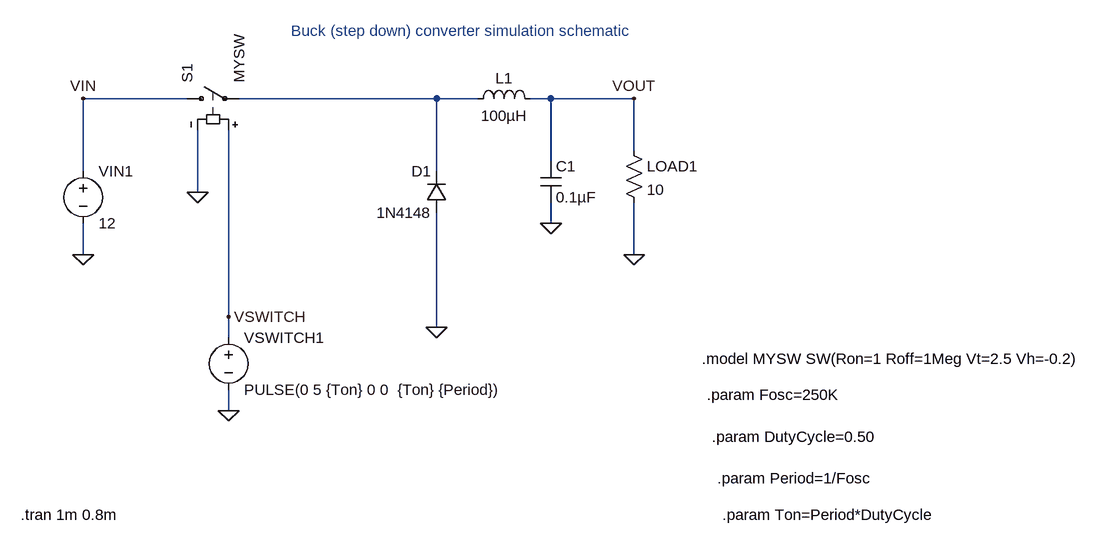
[diagram p0: schematic Draft9.asc]
Draft9.asc, the LTspice schematic file:
Version 4
SHEET 1 1200 680
WIRE -224 -240 -384 -240
WIRE 160 -240 -144 -240
WIRE 224 -240 160 -240
WIRE 336 -240 304 -240
WIRE 464 -240 336 -240
WIRE 464 -160 464 -240
WIRE 336 -144 336 -240
WIRE -384 -128 -384 -240
WIRE 160 -128 160 -240
WIRE -208 -96 -208 -192
WIRE 336 -48 336 -80
WIRE -384 0 -384 -48
WIRE 464 0 464 -80
WIRE -160 96 -160 -192
WIRE 160 112 160 -64
WIRE -160 128 -160 96
WIRE -160 240 -160 208
FLAG -384 0 0
FLAG -208 -96 0
FLAG -160 240 0
FLAG 160 112 0
FLAG 336 -48 0
FLAG 464 0 0
FLAG -384 -240 VIN
FLAG -160 96 VSWITCH
FLAG 464 -240 VOUT
SYMBOL voltage -384 -144 R0
WINDOW 123 0 0 Left 0
WINDOW 39 0 0 Left 0
SYMATTR InstName VIN1
SYMATTR Value 12
SYMBOL sw -240 -240 R270
SYMATTR InstName S1
SYMATTR Value MYSW
SYMBOL voltage -160 112 R0
WINDOW 123 0 0 Left 0
WINDOW 39 0 0 Left 0
SYMATTR InstName VSWITCH1
SYMATTR Value PULSE(0 5 {Ton} 0 0  {Ton} {Period})
SYMBOL ind 208 -224 R270
WINDOW 0 32 56 VTop 2
WINDOW 3 5 56 VBottom 2
SYMATTR InstName L1
SYMATTR Value 100µH
SYMBOL diode 176 -64 R180
WINDOW 0 24 64 Left 2
WINDOW 3 24 0 Left 2
SYMATTR InstName D1
SYMATTR Value 1N4148
SYMBOL cap 320 -144 R0
SYMATTR InstName C1
SYMATTR Value 0.1µF
SYMBOL res 448 -176 R0
SYMATTR InstName LOAD1
SYMATTR Value 10
TEXT -64 -344 Left 2 ;Buck (step down) converter simulation schematic
TEXT 568 160 Left 2 !.model MYSW SW(Ron=1 Roff=1Meg Vt=2.5 Vh=-0.2)
TEXT 576 216 Left 2 !.param Fosc=250K
TEXT 584 280 Left 2 !.param DutyCycle=0.50
TEXT 592 344 Left 2 !.param Period=1/Fosc
TEXT 600 400 Left 2 !.param Ton=Period*DutyCycle
TEXT -480 400 Left 2 !.tran 1m 0.8m

The netlist it stands for:
* Draft9.asc
VIN1 VIN 0 12
S1 VIN N001 VSWITCH 0 MYSW
VSWITCH1 VSWITCH 0 PULSE(0 5 {Ton} 0 0  {Ton} {Period})
L1 N001 VOUT 100µH
D1 0 N001 1N4148
C1 VOUT 0 0.1µF
R§LOAD1 VOUT 0 10
.model D D
.lib standard.dio
* Buck (step down) converter simulation schematic
.model MYSW SW(Ron=1 Roff=1Meg Vt=2.5 Vh=-0.2)
.param Fosc=250K
.param DutyCycle=0.50
.param Period=1/Fosc
.param Ton=Period*DutyCycle
.tran 1m 0.8m
.backanno
.end